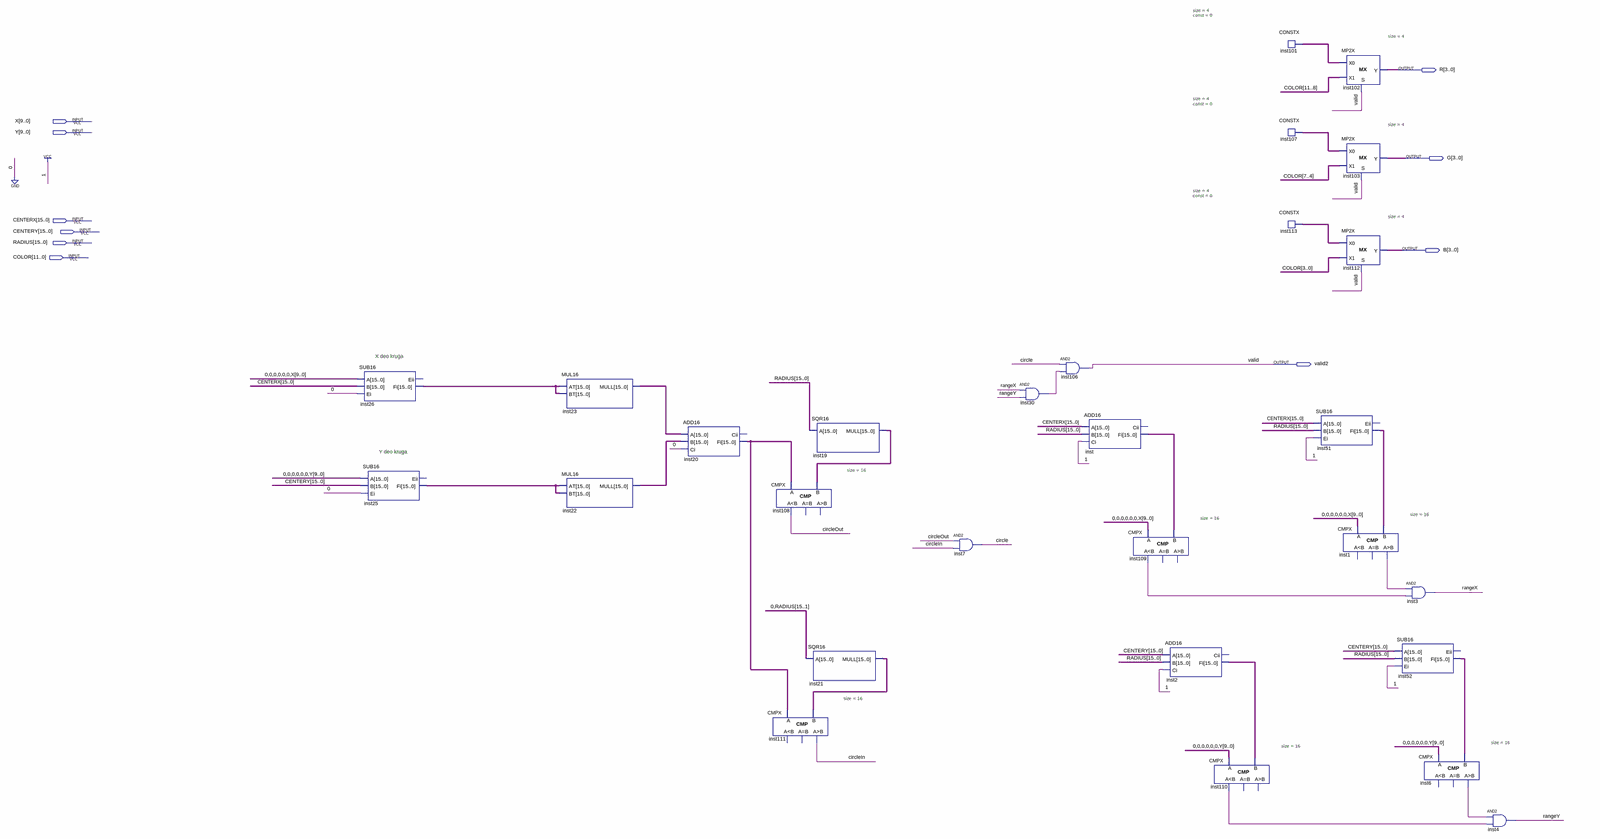
[diagram p0: schematic sheet, whole]
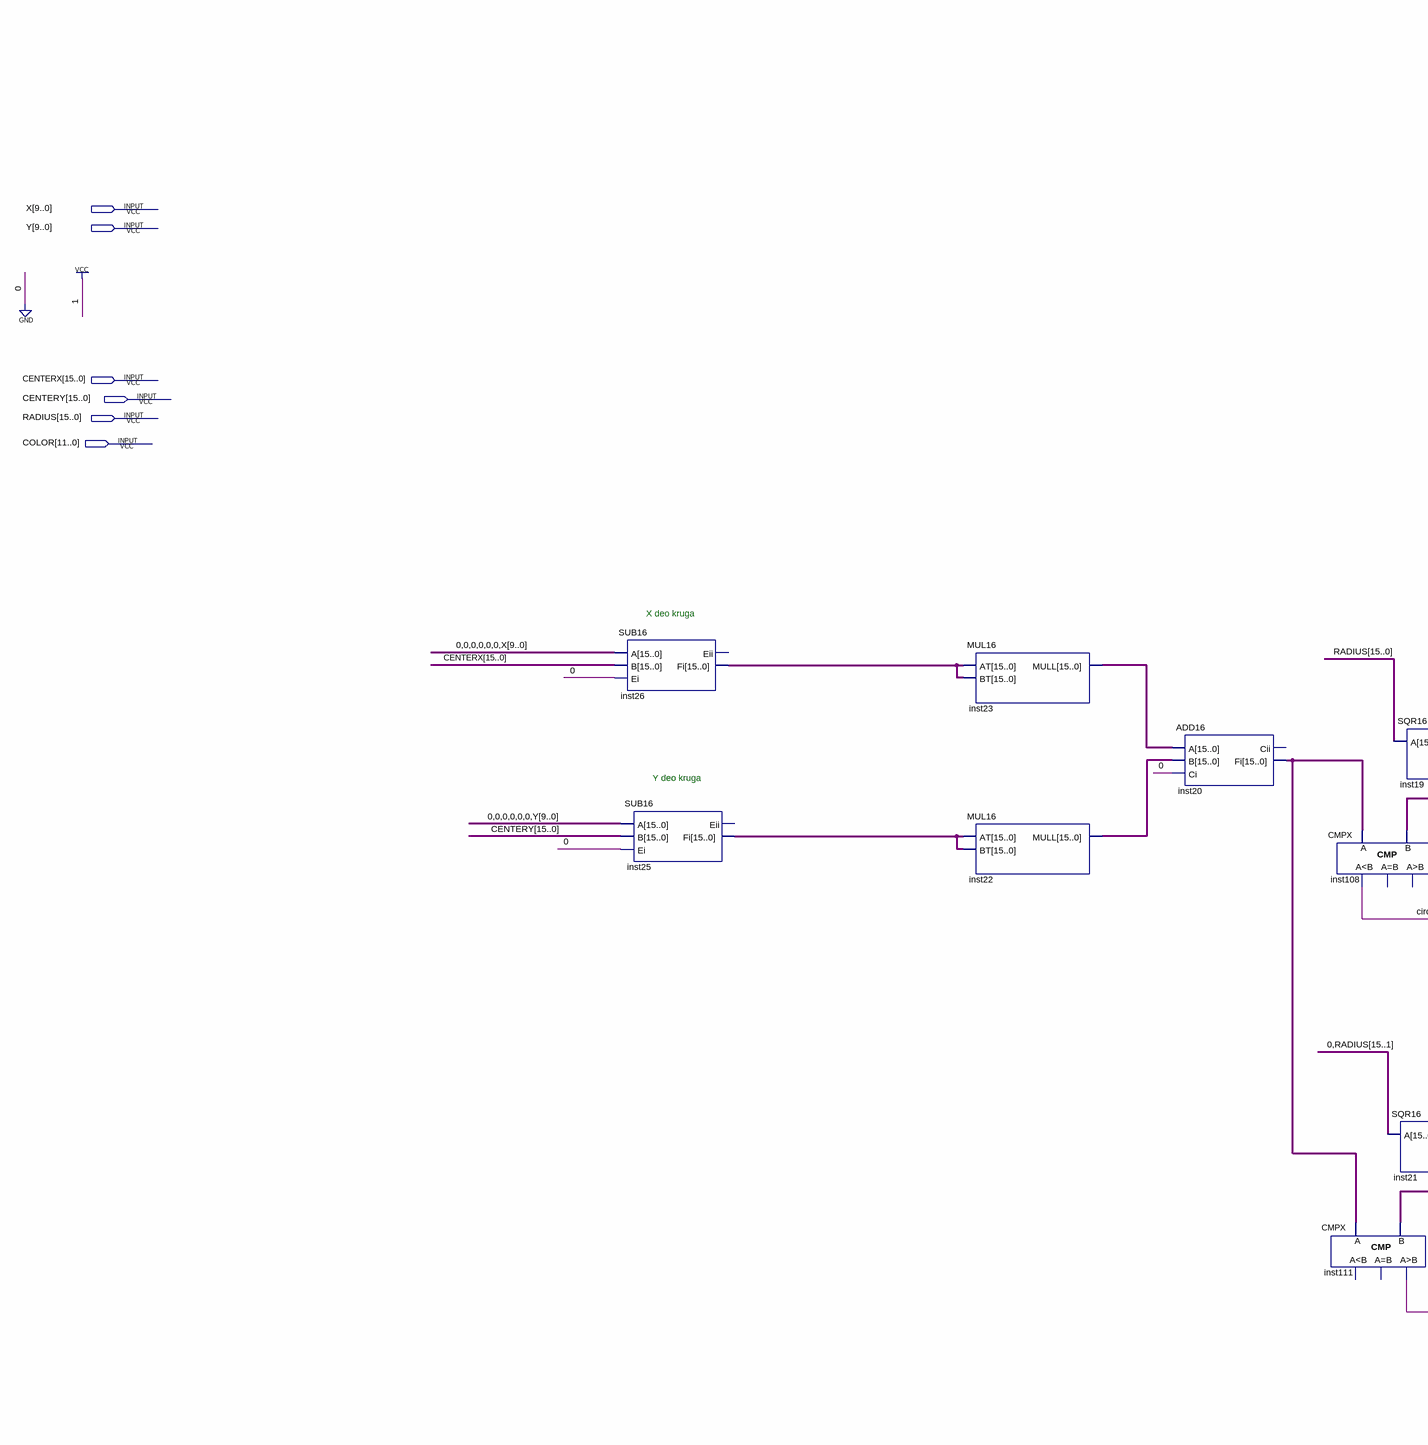
[diagram p1: schematic sheet, left part]
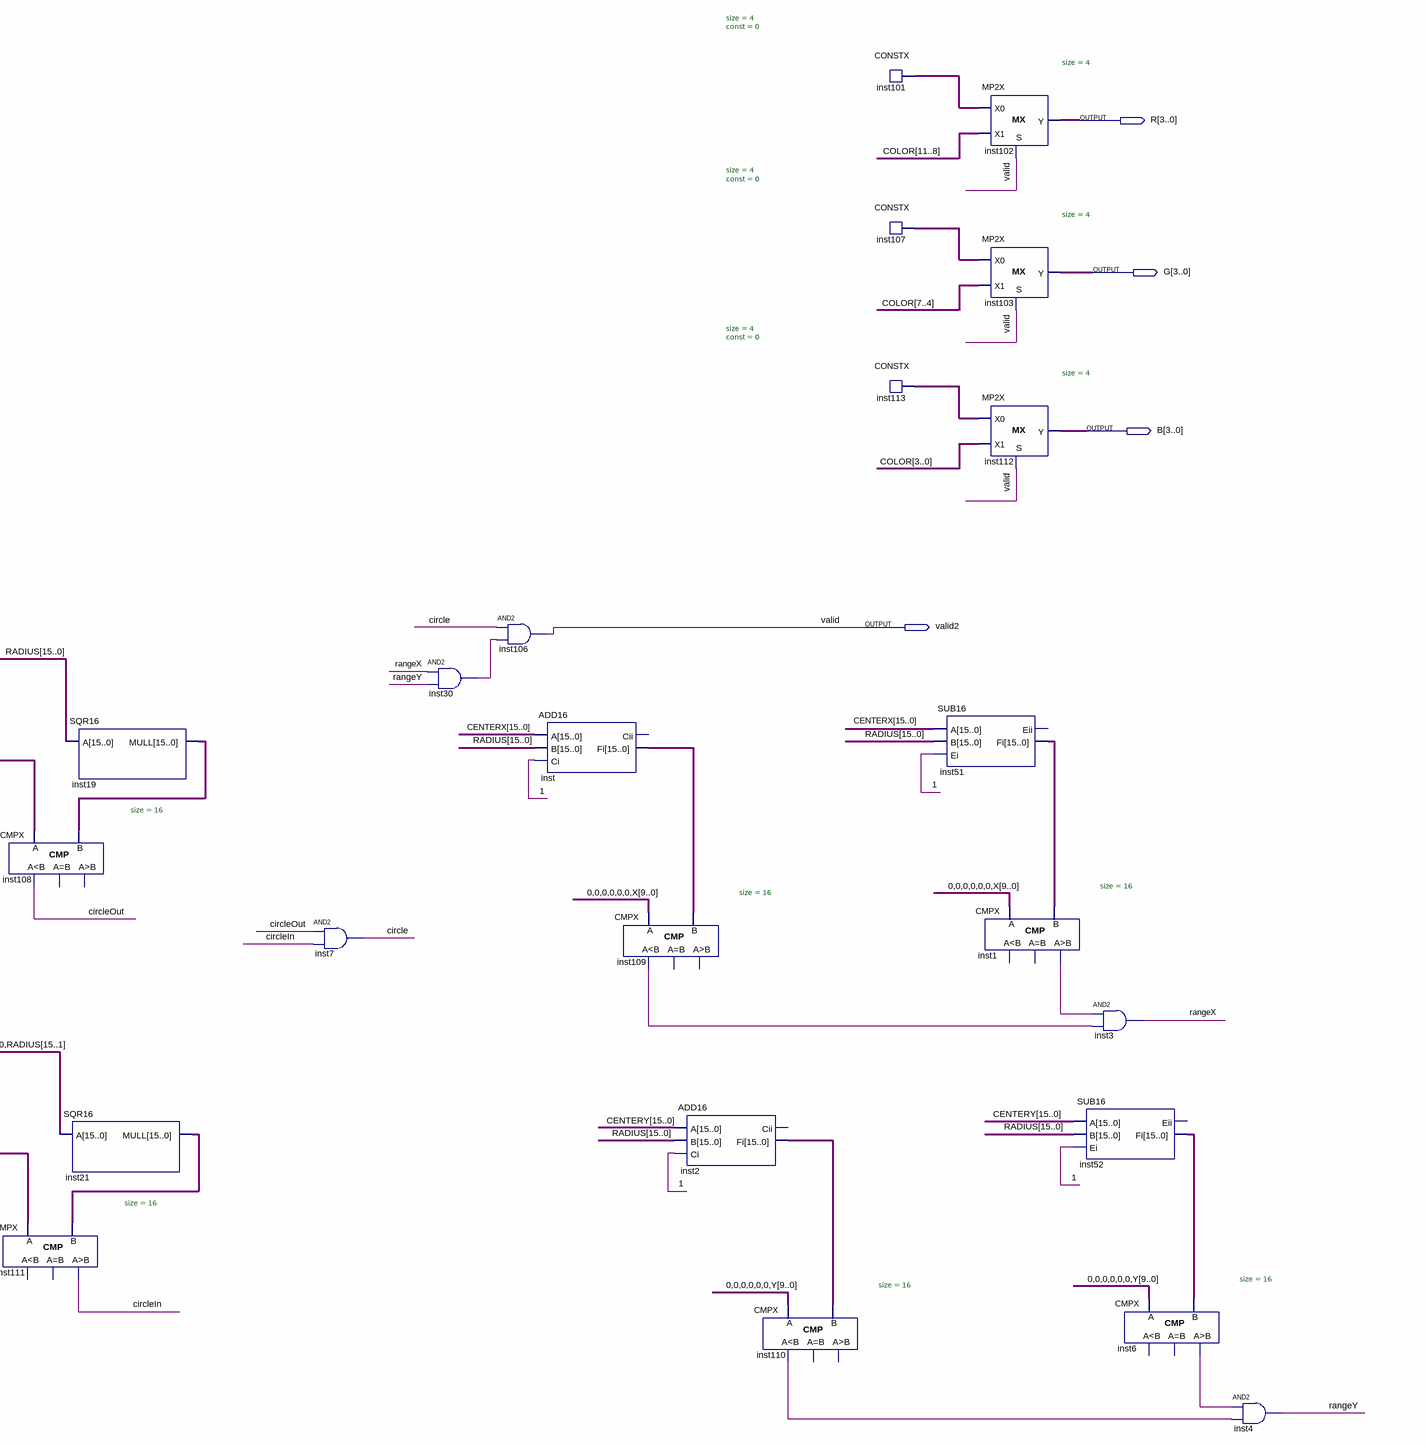
[diagram p2: schematic sheet, right part]
// Quartus schematic drawTarget.bdf as structural Verilog: 28 symbols, 10 pins
module drawTarget (
  input  [9:0] X,
  input  [9:0] Y,
  input  [15:0] CENTERX,
  input  [15:0] CENTERY,
  input  [15:0] RADIUS,
  input  [11:0] COLOR,
  output [3:0] R,
  output [3:0] G,
  output [3:0] B,
  output valid2
);

  wire circle, circleIn, circleOut, inst1_gr, inst6_gr, inst30_out, inst109_ls, inst110_ls, rangeX, rangeY;
  wire [3:0] inst101_data, inst107_data, inst113_data;
  wire [15:0] inst2_fi, inst19_mull, inst20_fi, inst21_mull, inst22_mull, inst23_mull, inst25_fi, inst26_fi,
       inst51_fi, inst52_fi, inst_fi;

  SUB16 inst26 (.A({{6{1'b0}}, X}), .B(CENTERX), .Ei(1'b0), .Fi(inst26_fi));  // open: Eii
  SUB16 inst25 (.A({{6{1'b0}}, Y}), .B(CENTERY), .Ei(1'b0), .Fi(inst25_fi));  // open: Eii
  MUL16 inst23 (.AT(inst26_fi), .BT(inst26_fi), .MULL(inst23_mull));
  MUL16 inst22 (.AT(inst25_fi), .BT(inst25_fi), .MULL(inst22_mull));
  ADD16 inst20 (.A(inst23_mull), .B(inst22_mull), .Ci(1'b0), .Fi(inst20_fi));  // open: Cii
  CMPX #(.size(16)) inst108 (.A(inst20_fi), .B(inst19_mull), .ls(circleOut));  // open: eq, gr
  CMPX #(.size(16)) inst111 (.A(inst20_fi), .B(inst21_mull), .gr(circleIn));  // open: ls, eq
  SQR16 inst19 (.A(RADIUS), .MULL(inst19_mull));
  SQR16 inst21 (.A({1'b0, RADIUS[15:1]}), .MULL(inst21_mull));
  and inst7 (circle, circleOut, circleIn);
  and inst30 (inst30_out, rangeX, rangeY);
  and inst106 (valid2, circle, inst30_out);
  ADD16 inst (.A(CENTERX), .B(RADIUS), .Ci(1'b1), .Fi(inst_fi));  // open: Cii
  CMPX #(.size(16)) inst109 (.A({{6{1'b0}}, X}), .B(inst_fi), .ls(inst109_ls));  // open: eq, gr
  ADD16 inst2 (.A(CENTERY), .B(RADIUS), .Ci(1'b1), .Fi(inst2_fi));  // open: Cii
  CMPX #(.size(16)) inst110 (.A({{6{1'b0}}, Y}), .B(inst2_fi), .ls(inst110_ls));  // open: eq, gr
  CONSTX #(.size(4), .\const (0)) inst101 (.data(inst101_data));
  CONSTX #(.size(4), .\const (0)) inst107 (.data(inst107_data));
  CONSTX #(.size(4), .\const (0)) inst113 (.data(inst113_data));
  SUB16 inst51 (.A(CENTERX), .B(RADIUS), .Ei(1'b1), .Fi(inst51_fi));  // open: Eii
  MP2X #(.size(4)) inst102 (.S(valid2), .X0(inst101_data), .X1(COLOR[11:8]), .Y(R));
  MP2X #(.size(4)) inst103 (.S(valid2), .X0(inst107_data), .X1(COLOR[7:4]), .Y(G));
  MP2X #(.size(4)) inst112 (.S(valid2), .X0(inst113_data), .X1(COLOR[3:0]), .Y(B));
  CMPX #(.size(16)) inst1 (.A({{6{1'b0}}, X}), .B(inst51_fi), .gr(inst1_gr));  // open: ls, eq
  SUB16 inst52 (.A(CENTERY), .B(RADIUS), .Ei(1'b1), .Fi(inst52_fi));  // open: Eii
  and inst3 (rangeX, inst1_gr, inst109_ls);
  CMPX #(.size(16)) inst6 (.A({{6{1'b0}}, Y}), .B(inst52_fi), .gr(inst6_gr));  // open: ls, eq
  and inst4 (rangeY, inst6_gr, inst110_ls);

  // Other names for the same wires on the sheet: valid = valid2

  // Notes on the sheet:
  //   X deo kruga
  //   Y deo kruga
endmodule
